# EAGLE design flow_7s_wo_uart_manual (EAGLE 7.1.0)
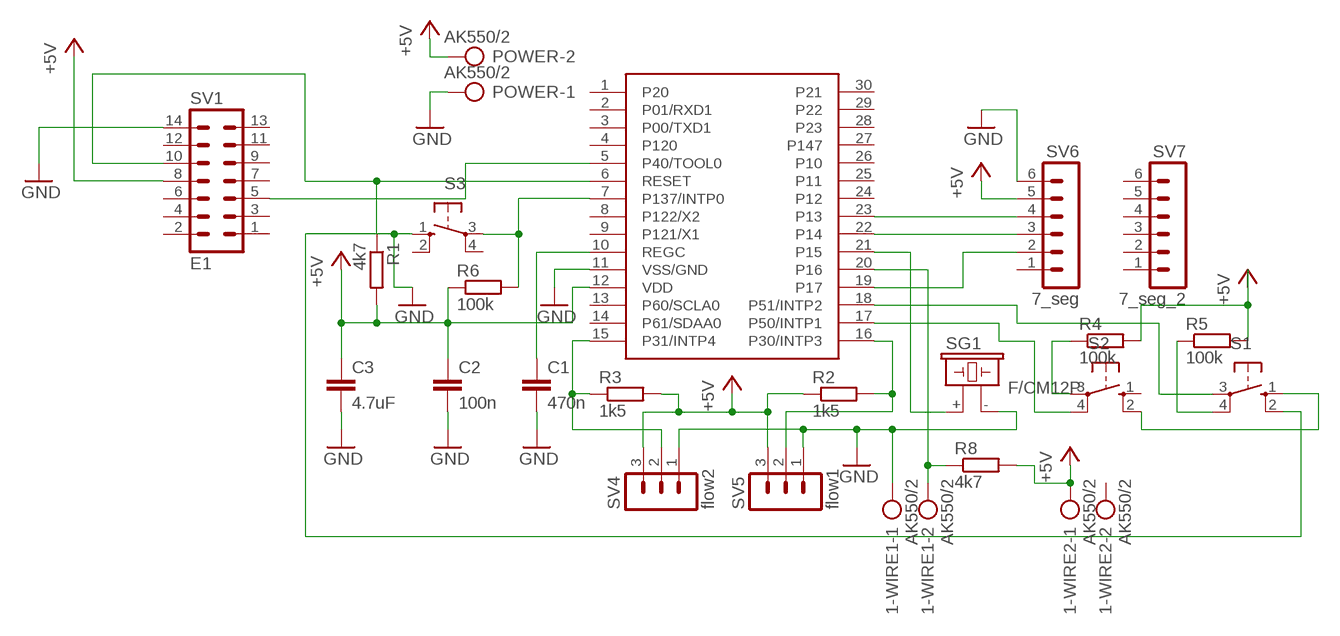
[diagram p0: schematic, sheet 1]

## Parts
1-WIRE1  AK550/2  [AK550/2]
1-WIRE2  AK550/2  [AK550/2]
C1  470n  C-EUC1206  [C1206]
C2  100n  C-EUC1206  [C1206]
C3  4.7uF  C-EUC1206  [C1206]
POWER  AK550/2  [AK550/2]
R1  4k7  R-EU_R1206  [R1206]
R2  1k5  R-EU_R1206  [R1206]
R3  1k5  R-EU_R1206  [R1206]
R4  100k  R-EU_R1206  [R1206]
R5  100k  R-EU_R1206  [R1206]
R6  100k  R-EU_R1206  [R1206]
R8  4k7  R-EU_R1206  [R1206]
S1  10-XX  [B3F-10XX]
S2  10-XX  [B3F-10XX]
S3  10-XX  [B3F-10XX]
SG1  F/CM12P  [F/CM12P]
SV1  E1  MA07-2  [MA07-2]
SV4  flow2  MA03-1  [MA03-1]
SV5  flow1  MA03-1  [MA03-1]
SV6  7_seg  MA06-1  [MA06-1]
SV7  7_seg_2  MA06-1  [MA06-1]
U$1  R5F100A  [SSOP30]

## Nets
+5V: 1-WIRE2.1 C2.1 C3.1 POWER.2 R1.2 R2.1 R3.2 R4.2 R5.2 R6.1 R8.2 SV1.8 SV4.3 SV5.3 SV6.5 U$1.12(VDD)
GND: 1-WIRE1.1 C1.2 C2.2 C3.2 POWER.1 S1.2(S1) S3.1(S) SG1.- SV1.14 SV4.1 SV5.1 SV6.6 U$1.11(VSS/GND)
N$1: C1.1 U$1.10(REGC)
N$2: R1.1 SV1.10 U$1.6(RESET)
N$3: SV1.5 U$1.5(P40/TOOL0)
N$5: R6.2 S3.3(P) U$1.7(P137/INTP0)
N$6: R4.1 S2.3(P)
N$8: SV6.4 U$1.23(P13)
N$9: R2.2 SV5.2 U$1.16(P30/INTP3)
N$10: SV6.3 U$1.22(P14)
N$11: R3.1 SV4.2 U$1.15(P31/INTP4)
N$12: SV6.2 U$1.19(P17)
N$13: SG1.+ U$1.21(P15)
N$14: S1.3(P) U$1.18(P51/INTP2)
N$15: S2.4(P1) U$1.17(P50/INTP1)
N$19: 1-WIRE1.2 R8.1 U$1.20(P16)
N$20: S1.1(S) S2.2(S1)
N$21: R5.1 S1.4(P1)
Unconnected: 1-WIRE2.2 S2.1(S) S3.2(S1) S3.4(P1) SV1.1 SV1.2 SV1.3 SV1.4 SV1.6 SV1.7 SV1.9 SV1.11 SV1.12 SV1.13 SV6.1 SV7.1 SV7.2 SV7.3 SV7.4 SV7.5 SV7.6 U$1.1(P20) U$1.2(P01/RXD1) U$1.3(P00/TXD1) U$1.4(P120) U$1.8(P122/X2) U$1.9(P121/X1) U$1.13(P60/SCLA0) U$1.14(P61/SDAA0) U$1.24(P12) U$1.25(P11) U$1.26(P10) U$1.27(P147) U$1.28(P23) U$1.29(P22) U$1.30(P21)

## Library data of the parts
1-WIRE1 1-WIRE2 POWER = con-ptr500:AK550/2: CONNECTOR; OC_FARNELL: unknown; OC_NEWARK: unknown
C1-C3 = rcl:C-EU: CAPACITOR, European symbol
R1-R6 R8 = rcl:R-EU_: RESISTOR, European symbol
S1-S3 = switch-omron:10-XX: OMRON SWITCH; MPN: B3F-1000; OC_FARNELL: 176432; OC_NEWARK: 36M3542
SG1 = buzzer:F/CM12P: BUZZER Source: Buerklin; OC_FARNELL: unknown; OC_NEWARK: unknown
SV1 = con-lstb:MA07-2: PIN HEADER; OC_FARNELL: unknown; OC_NEWARK: unknown
SV4 SV5 = con-lstb:MA03-1: PIN HEADER; OC_FARNELL: unknown; OC_NEWARK: unknown
SV6 SV7 = con-lstb:MA06-1: PIN HEADER; OC_FARNELL: unknown; OC_NEWARK: unknown
U$1 = renesas_rl78:R5F100A

## Board
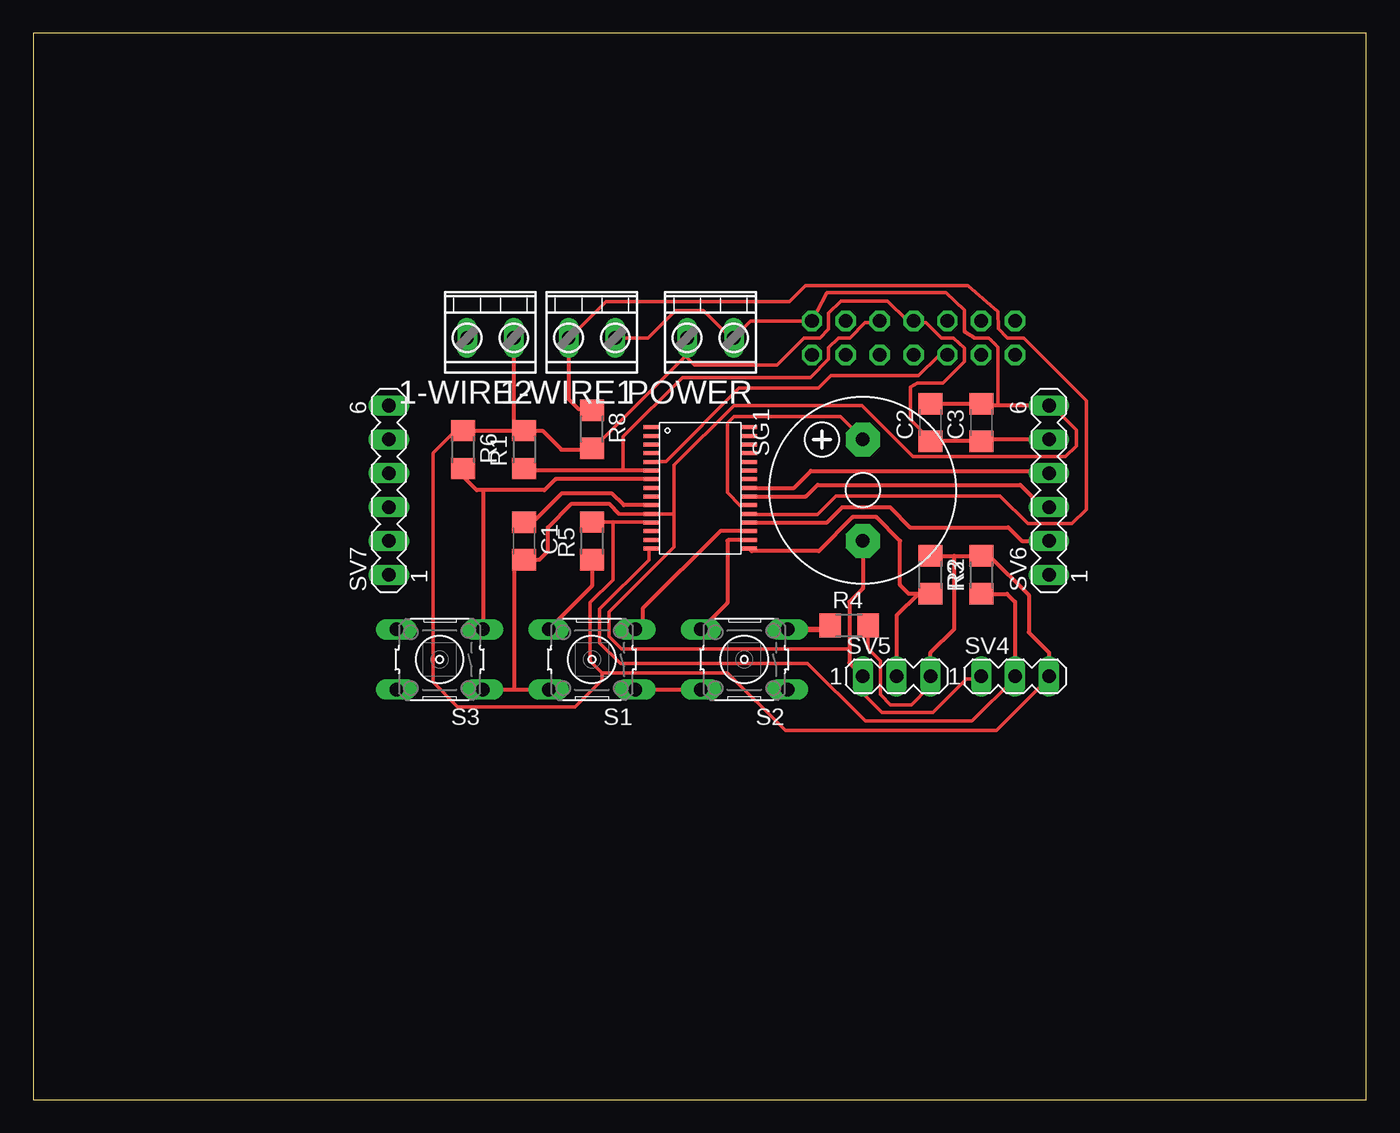
[diagram p1: board, top side]
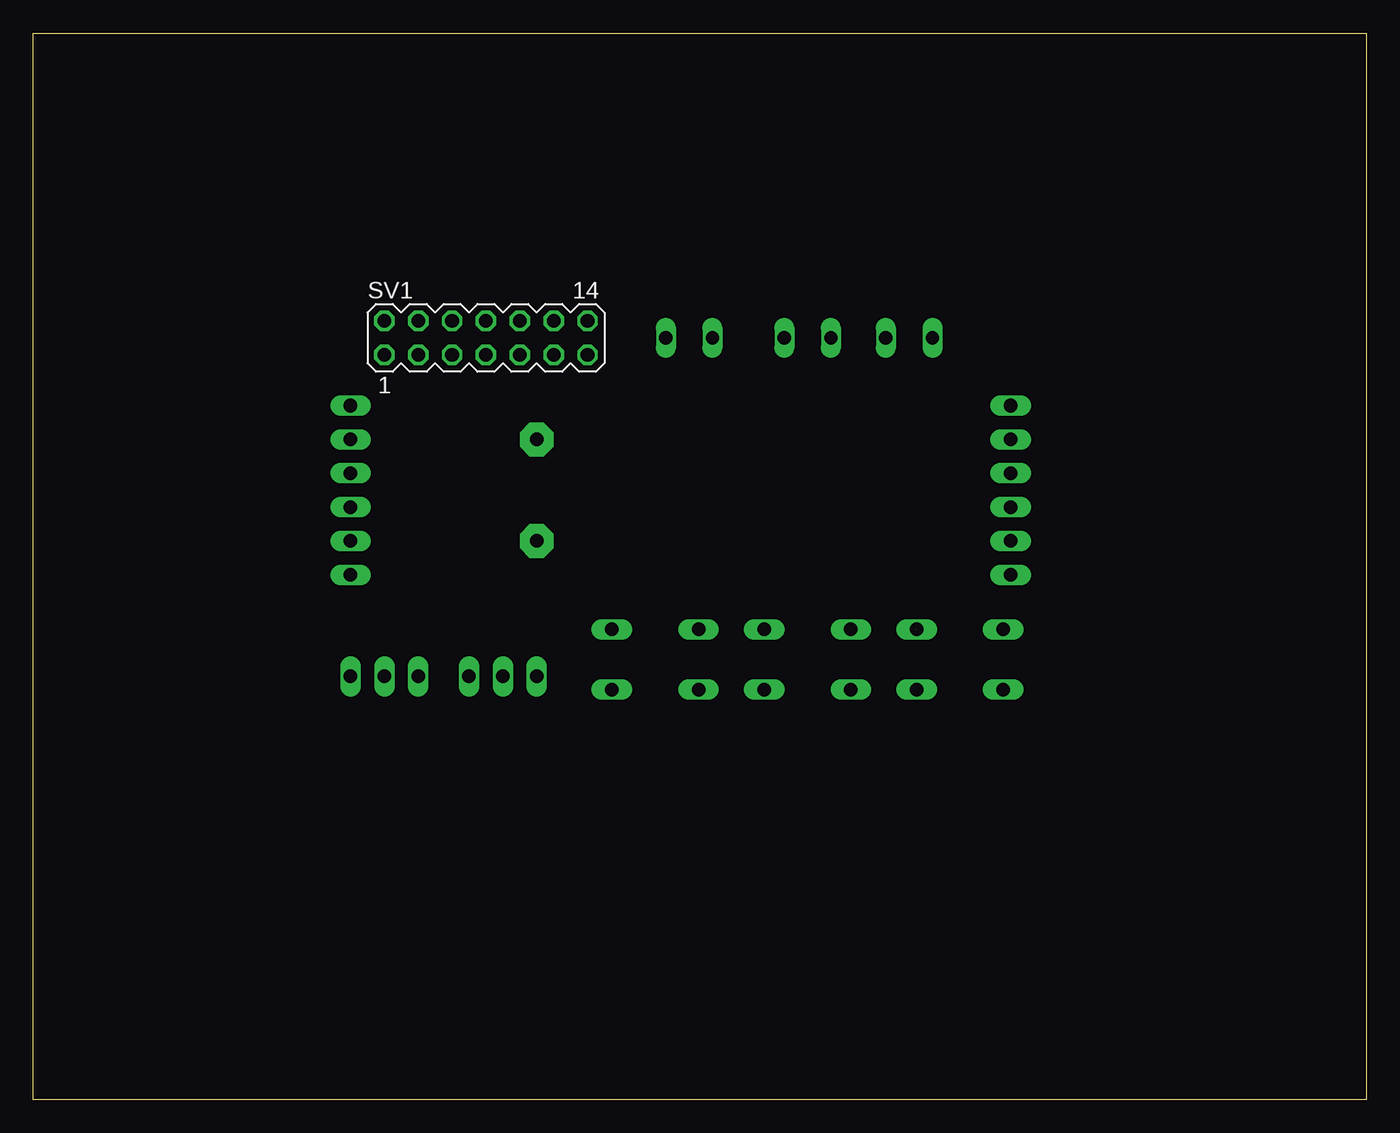
[diagram p2: board, bottom side, seen from below]

Size 100 x 80 mm. Coordinates in mm from the lower left corner, seen from the top.
Outline: 0,0 100,0 100,80 0,80 0,0
Copper layers (1*16): Top 0.035mm / dielectric 1.5mm / Bottom 0.035mm
Design rules "default": minimum track width 10mil, minimum drill 24mil, track to track 8mil, track to pad 8mil, pad to pad 8mil, via to via 8mil, smd to smd 8mil, copper to edge 40mil, drill to drill 8mil, minimum pad ring 10mil, minimum via ring 8mil, stop-mask expansion 4mil, vias tented up to drill 0mil, thermal gap 10mil

### Footprints (pad centres in the part's own frame; a part is rotated, then mirrored left to right if it is on the bottom)
AK550/2 = drill 1 pad 1.5 long: 1 -1.75,0; 2 1.75,0
C1206 = smd 1.6 x 1.8: 1 -1.4,0; 2 1.4,0
R1206 = smd 1.6 x 1.803: 1 -1.422,0; 2 1.422,0
B3F-10XX = drill 1.016 long: 1 -3.251,2.261; 2 3.251,2.261; 3 -3.251,-2.261; 4 3.251,-2.261
F/CM12P = drill 1.016 pad 2.54 octagon: + 3.81,0; - -3.81,0
MA07-2 = drill 1.016 octagon: 1 -7.62,-1.27; 2 -7.62,1.27; 3 -5.08,-1.27; 4 -5.08,1.27; 5 -2.54,-1.27; 6 -2.54,1.27; 7 0,-1.27; 8 0,1.27; 9 2.54,-1.27; 10 2.54,1.27; 11 5.08,-1.27; 12 5.08,1.27; 13 7.62,-1.27; 14 7.62,1.27
MA03-1 = drill 1.016 long: 1 -2.54,0; 2 0,0; 3 2.54,0
MA06-1 = drill 1.016 long: 1 -6.35,0; 2 -3.81,0; 3 -1.27,0; 4 1.27,0; 5 3.81,0; 6 6.35,0
SSOP30 = smd 0.3 x 1.2: 1 0.35,-0.6; 2 1,-0.6; 3 1.65,-0.6; 4 2.3,-0.6; 5 2.95,-0.6; 6 3.6,-0.6; 7 4.25,-0.6; 8 4.9,-0.6; 9 5.55,-0.6; 10 6.2,-0.6; 11 6.85,-0.6; 12 7.5,-0.6; 13 8.15,-0.6; 14 8.8,-0.6; 15 9.45,-0.6; 16 9.45,6.7; 17 8.8,6.7; 18 8.15,6.7; 19 7.5,6.7; 20 6.85,6.7; 21 6.2,6.7; 22 5.55,6.7; 23 4.9,6.7; 24 4.25,6.7; 25 3.6,6.7; 26 2.95,6.7; 27 2.3,6.7; 28 1.65,6.7; 29 1,6.7; 30 0.35,6.7

### Placement (x,y rotation side)
1-WIRE1  41.91,57.15 180 top
1-WIRE2  34.29,57.15 180 top
C1  36.83,41.91 270 top
C2  67.31,50.8 90 top
C3  71.12,50.8 90 top
POWER  50.8,57.15 180 top
R1  36.83,48.77 90 top
R2  67.31,39.37 270 top
R3  71.12,39.37 90 top
R4  61.21,35.56 0 top
R5  41.91,41.91 90 top
R6  32.26,48.77 270 top
R8  41.91,50.29 270 top
S1  41.91,33.02 180 top
S2  53.34,33.02 180 top
S3  30.48,33.02 180 top
SG1  62.23,45.72 90 top
SV1  66.04,57.15 0 bottom
SV4  73.66,31.75 0 top
SV5  64.77,31.75 0 top
SV6  76.2,45.72 90 top
SV7  26.67,45.72 90 top
U$1  46.99,50.8 270 top

### Tracks (layer width: path | path; a pad name or v marks a point on that pad's centre or on a via)
+5V
  Top 0.254: C2.1 67.21,49.61 65.8,51.01 65.8,53.45 66.32,53.75 68.25,53.75 69.87,55.37 69.87,56.39 69.04,57.15 68.12,57.15 66.98,58.29 66.06,58.29 SV1.8 65.84,58.52 65.49,58.5 64.09,59.92 60.58,59.92 59.66,59 59.66,57.81 59,57.15 57.84,57.15 55.78,55.09 49.61,55.09 48.92,55.78 | 48.92,55.78 48.92,57.15 POWER.2 48.92,55.78 | 48.92,55.78 42.06,48.92 R8.2 | R4.2 62.64,35.43 62.64,33.83 63.55,32.92 63.55,30.38 64.31,29.62 65.89,29.62 67.21,30.95 SV5.3 | 43.48,43.32 43.48,38.99 41.78,37.29 41.78,32.89 42.67,32 | 42.67,32 52.09,32.01 56.41,27.7 72.26,27.68 76.12,31.55 SV4.3 | 32.23,49.61 32.23,50.06 R6.1 | 42.67,32 42.67,31.5 40.64,29.46 31.84,29.46 29.99,31.31 29.99,48.51 31.64,50.16 32.8,50.16 32.83,50.19
  Top 0.305: U$1.12 43.48,43.32 41.94,43.3 R5.2 | 1-WIRE2.1 36.04,50.98 R1.2 | R1.2 38.2,50.19 39.62,48.77 41.81,48.77 R8.2 | R2.1 69.09,40.79 | 69.09,40.79 R3.2 71.73,40.79 74.68,37.85 74.68,35.05 76.2,33.53 SV4.3 | SV5.3 67.31,33.53 69.09,35.31 69.09,40.79 | SV6.5 71.25,49.53 C3.1 C2.1 | R6.1 32.83,50.19 R1.2
GND
  Top 0.254: 1-WIRE1.1 46.12,57.15 48.17,59.2 50.29,59.21 52.35,57.15 POWER.1 53.82,58.42 SV1.14 59.54,60.53 68.46,60.53 69.84,59.23 69.86,57.61 70.64,57.15 71.69,57.15 72.38,56.46 72.38,52.07 | SV4.1 71.09,31.55 70,31.55 67.5,29.03 63.66,29.03 62.19,30.5 62.41,31.55 SV5.1 | 61.27,34.06 61.21,33.8 44.15,33.8 43.2,34.75 43.2,36.58 48.08,41.45 48.08,43.94 | 48.08,43.94 48.08,47.6 52.55,52.06 62.15,52.08 66,48.23 77.44,48.23 78.26,49.05 78.26,50.24 76.61,51.89 SV6.6 | 43.93,43.95 U$1.11 48.07,43.95 48.08,43.94
  Top 0.305: C1.2 36.7,40.51 36.07,39.88 | S3.1 36.07,30.76 | 36.07,30.76 S1.2 | C1.2 36.45,40.51 36.07,40.13 36.07,30.76 | SV6.6 72.38,52.07 71.25,52.07 C3.2 C2.2 | C1.2 37.97,40.51 38.61,41.15 38.61,42.93 40.39,44.7 43.18,44.7 43.93,43.95 | SG1.- 62.23,38.35 61.21,37.34 61.21,33.8 61.21,32.77 SV5.1
N$1
  Top 0.305: U$1.10 44.3,44.6 43.43,45.47 39.62,45.47 37.59,43.43 36.95,43.43 C1.1
N$2
  Top 0.254: 44.26,47.2 44.26,49.74 48.69,54.18 58.32,54.18 59.66,55.55 59.66,56.4 60.39,57.15 61.27,57.15 62.41,58.29 63.32,58.29 SV1.10
  Top 0.305: U$1.6 44.26,47.2 36.98,47.2 R1.1
N$3
  Top 0.254: U$1.5 46.36,47.87 47.47,47.87 52.96,53.39 58.91,53.39 59.85,54.33 66.4,54.33 66.42,54.31 67.89,55.78 68.58,55.78 SV1.5
N$5  (1 unrouted)
  Top 0.305: U$1.7 39.18,46.55 38.35,45.72 33.78,45.72 | 33.78,45.72 33.27,45.72 32.26,46.74 R6.2 | 33.76,35.28 33.78,35.31 33.78,45.72
N$6
  Top 0.406: S2.3 59.51,35.28 R4.1
N$8
  Top 0.305: U$1.23 57.08,45.9 58.34,47.16 75.62,47.16 SV6.4
N$9
  Top 0.305: SV5.2 64.77,36.32 66.4,37.95 R2.2 65.68,37.95 65.02,38.61 65.02,41.91 63.25,43.69 61.47,43.69 58.93,41.15 53.89,41.15 U$1.16
N$10
  Top 0.305: U$1.22 57.95,45.25 58.84,46.12 74.05,46.12 75.69,44.45 SV6.3
N$11
  Top 0.254: U$1.15 46.18,41.38 46.18,40.49 42.49,36.8 42.49,34.27 44.04,32.72 58.08,32.72 62.42,28.39 70.43,28.39 73.61,31.55 SV4.2
  Top 0.305: R3.1 73.05,37.95 73.66,37.34 SV4.2
N$12
  Top 0.305: SV6.2 74.17,41.91 73.15,42.93 65.79,42.93 64.26,44.45 60.71,44.45 59.56,43.3 U$1.19
N$13
  Top 0.254: U$1.21 53.49,44.58 53.03,44.58 52.07,45.54 52.07,50.75 52.56,51.24 60.55,51.24 62.18,49.61 SG1.+
N$14
  Top 0.305: U$1.18 51.54,42.65 45.72,36.83 45.72,35.84 S1.3
N$15
  Top 0.305: U$1.17 52.16,42 52.07,41.91 52.07,37.26 S2.4
N$19
  Top 0.254: U$1.20 53.72,43.89 58.82,43.89 60.22,45.3 72.53,45.3 74.62,43.2 77.93,43.2 79.02,44.26 79.02,52.44 74.33,57.15 73.07,57.15 72.4,57.84 72.36,59.12 70.13,61.09 57.95,61.09 56.73,59.87 42.95,59.87 40.23,57.15 1-WIRE1.2
  Top 0.305: 1-WIRE1.2 40.16,52.55 40.89,51.82 41.81,51.82 R8.1
N$20
  Top 0.305: S1.1 S2.2
N$21
  Top 0.305: R5.1 41.91,38.53 S1.4